# Altium schematic sheet PLLSubsectionWaveyRadar.SchDoc: PLL Subsection WaveyRadar Schematic
size Letter; Author: Will Vu; CompanyName: Raccoon Wireless; DrawnBy: Will Vu, Raccoon Wireless; Engineer: Will Vu; Organization: Raccoon Wireless; DocumentNumber: 2-02; Revision: 2; SheetNumber: 2; SheetTotal: 15
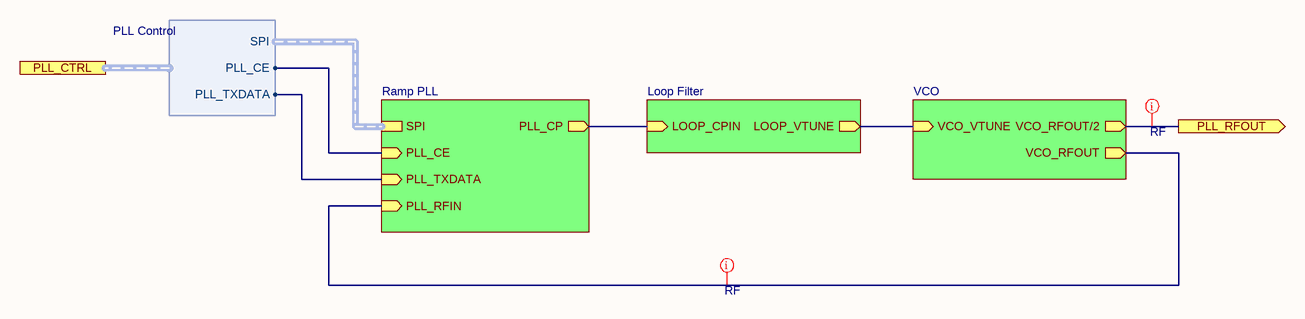
[diagram p0: PLLSubsectionWaveyRadar.SchDoc]

## Sub-sheets
Loop Filter = LoopFilterWaveyRadar.SchDoc: LOOP_VTUNE (out), LOOP_CPIN (in)
Ramp PLL = RampPLLWaveyRadar.SchDoc: SPI (harness SPI), PLL_RFIN (in), PLL_TXDATA (in), PLL_CE (in), PLL_CP (out)
VCO = VCOWaveyRadar.SchDoc: VCO_RFOUT/2 (out), VCO_RFOUT (out), VCO_VTUNE (in)

## Ports
PLL_CTRL (harness PLL Control), PLL_RFOUT (out)

## Harnesses
PLL Control: PLL_CE, PLL_TXDATA, SPI

## Nets
PLL_RFOUT: port PLL_RFOUT, sheet VCO/VCO_RFOUT/2
(unnamed): sheet Ramp PLL/PLL_RFIN, sheet VCO/VCO_RFOUT
(unnamed): sheet Ramp PLL/PLL_TXDATA, port PLL_CTRL.PLL_TXDATA
(unnamed): sheet Ramp PLL/PLL_CE, port PLL_CTRL.PLL_CE
(unnamed): sheet Ramp PLL/PLL_CP, sheet Loop Filter/LOOP_CPIN
(unnamed): sheet Loop Filter/LOOP_VTUNE, sheet VCO/VCO_VTUNE

## Layout directives
net class RF: (no net found under the mark), PLL_RFOUT

## Notes on the sheet
- /